# Vivado block design design_2, xc7a100tcsg324-1, Vivado 2021.2
# (continued, part 2 of 3)
current_bd_instance /NN/Multiplier_Adder_Relu_6

# ---- hierarchy /NN/Multiplier_Adder_Relu_7 ----
current_bd_instance /NN/Multiplier_Adder_Relu_7
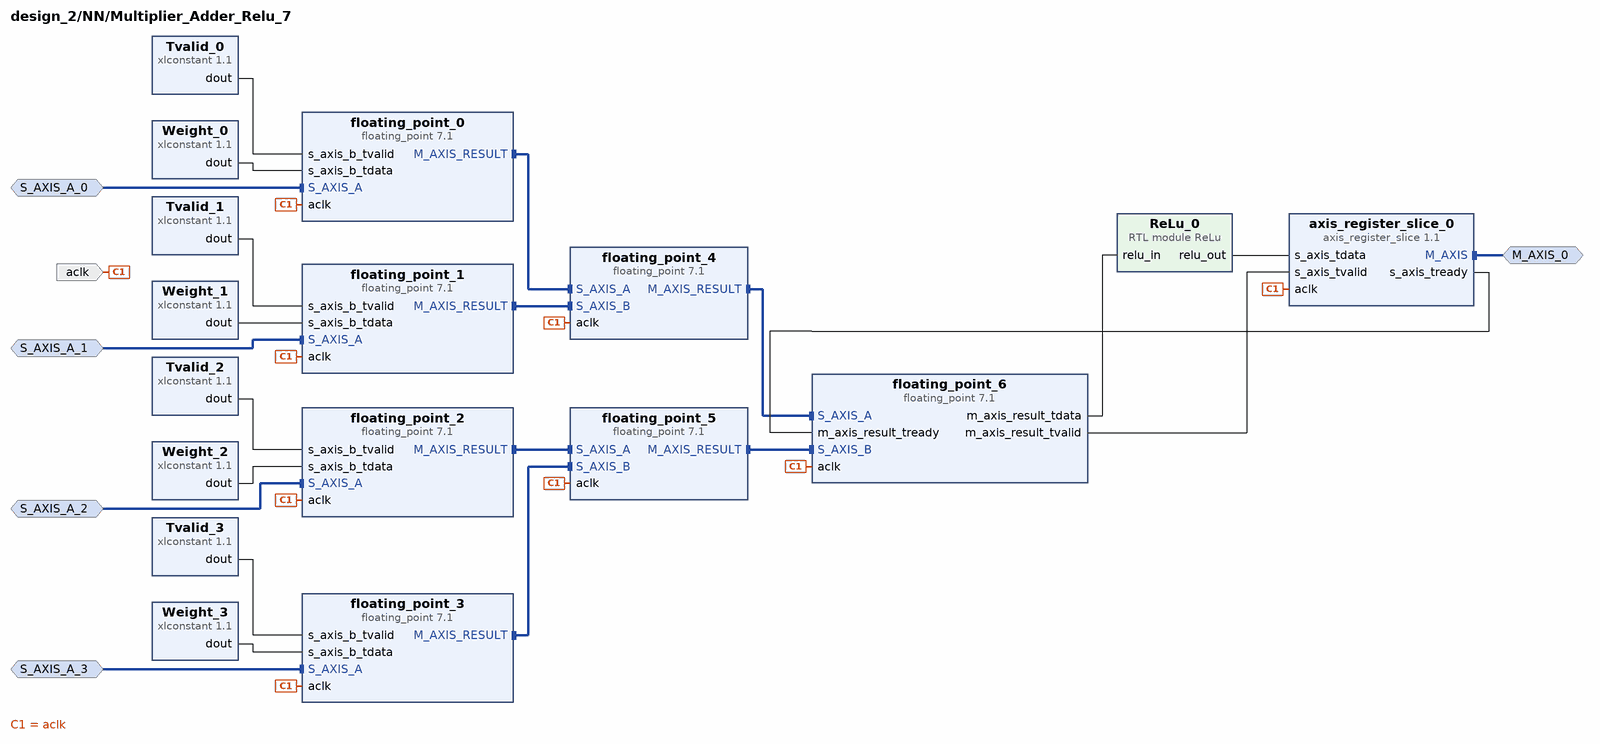
[diagram p10: block diagram inside /NN/Multiplier_Adder_Relu_7]
create_bd_intf_pin -mode Master -vlnv xilinx.com:interface:axis_rtl:1.0 M_AXIS_0
create_bd_intf_pin -mode Slave -vlnv xilinx.com:interface:axis_rtl:1.0 S_AXIS_A_0
create_bd_intf_pin -mode Slave -vlnv xilinx.com:interface:axis_rtl:1.0 S_AXIS_A_1
create_bd_intf_pin -mode Slave -vlnv xilinx.com:interface:axis_rtl:1.0 S_AXIS_A_2
create_bd_intf_pin -mode Slave -vlnv xilinx.com:interface:axis_rtl:1.0 S_AXIS_A_3
create_bd_pin -dir I -type clk aclk

create_bd_cell -type ip -vlnv xilinx.com:ip:floating_point:7.1 floating_point_2
set_property -dict [list \
  CONFIG.C_Latency 9 \
  CONFIG.C_Mult_Usage Full_Usage \
  CONFIG.C_Rate 1 \
  CONFIG.C_Result_Exponent_Width 8 \
  CONFIG.C_Result_Fraction_Width 24 \
  CONFIG.Maximum_Latency true \
  CONFIG.Operation_Type Multiply \
  CONFIG.Result_Precision_Type Single \
] [get_bd_cells floating_point_2]
create_bd_cell -type ip -vlnv xilinx.com:ip:floating_point:7.1 floating_point_3
set_property -dict [list \
  CONFIG.C_Latency 9 \
  CONFIG.C_Mult_Usage Full_Usage \
  CONFIG.C_Rate 1 \
  CONFIG.C_Result_Exponent_Width 8 \
  CONFIG.C_Result_Fraction_Width 24 \
  CONFIG.Maximum_Latency true \
  CONFIG.Operation_Type Multiply \
  CONFIG.Result_Precision_Type Single \
] [get_bd_cells floating_point_3]
create_bd_cell -type ip -vlnv xilinx.com:ip:floating_point:7.1 floating_point_0
set_property -dict [list \
  CONFIG.C_Latency 9 \
  CONFIG.C_Mult_Usage Full_Usage \
  CONFIG.C_Rate 1 \
  CONFIG.C_Result_Exponent_Width 8 \
  CONFIG.C_Result_Fraction_Width 24 \
  CONFIG.Has_ARESETn false \
  CONFIG.Has_B_TLAST false \
  CONFIG.Maximum_Latency true \
  CONFIG.Operation_Type Multiply \
  CONFIG.RESULT_TLAST_Behv Null \
  CONFIG.Result_Precision_Type Single \
] [get_bd_cells floating_point_0]
create_bd_cell -type ip -vlnv xilinx.com:ip:floating_point:7.1 floating_point_1
set_property -dict [list \
  CONFIG.C_Latency 9 \
  CONFIG.C_Mult_Usage Full_Usage \
  CONFIG.C_Rate 1 \
  CONFIG.C_Result_Exponent_Width 8 \
  CONFIG.C_Result_Fraction_Width 24 \
  CONFIG.Maximum_Latency true \
  CONFIG.Operation_Type Multiply \
  CONFIG.Result_Precision_Type Single \
] [get_bd_cells floating_point_1]
create_bd_cell -type ip -vlnv xilinx.com:ip:floating_point:7.1 floating_point_4
set_property -dict [list \
  CONFIG.Add_Sub_Value Add \
  CONFIG.C_Latency 12 \
  CONFIG.C_Mult_Usage Full_Usage \
  CONFIG.C_Rate 1 \
  CONFIG.C_Result_Exponent_Width 8 \
  CONFIG.C_Result_Fraction_Width 24 \
  CONFIG.Maximum_Latency true \
  CONFIG.Operation_Type Add_Subtract \
  CONFIG.Result_Precision_Type Single \
] [get_bd_cells floating_point_4]
create_bd_cell -type ip -vlnv xilinx.com:ip:floating_point:7.1 floating_point_5
set_property -dict [list \
  CONFIG.Add_Sub_Value Add \
  CONFIG.C_Latency 12 \
  CONFIG.C_Mult_Usage Full_Usage \
  CONFIG.C_Rate 1 \
  CONFIG.C_Result_Exponent_Width 8 \
  CONFIG.C_Result_Fraction_Width 24 \
  CONFIG.Maximum_Latency true \
  CONFIG.Operation_Type Add_Subtract \
  CONFIG.Result_Precision_Type Single \
] [get_bd_cells floating_point_5]
create_bd_cell -type ip -vlnv xilinx.com:ip:floating_point:7.1 floating_point_6
set_property -dict [list \
  CONFIG.Add_Sub_Value Add \
  CONFIG.C_Latency 12 \
  CONFIG.C_Mult_Usage Full_Usage \
  CONFIG.C_Rate 1 \
  CONFIG.C_Result_Exponent_Width 8 \
  CONFIG.C_Result_Fraction_Width 24 \
  CONFIG.Maximum_Latency true \
  CONFIG.Operation_Type Add_Subtract \
  CONFIG.Result_Precision_Type Single \
] [get_bd_cells floating_point_6]
create_bd_cell -type ip -vlnv xilinx.com:ip:xlconstant:1.1 Weight_0
set_property -dict {CONFIG.CONST_VAL b00111111010010101100111101101010 CONFIG.CONST_WIDTH 32} [get_bd_cells Weight_0]
create_bd_cell -type ip -vlnv xilinx.com:ip:xlconstant:1.1 Weight_1
set_property -dict {CONFIG.CONST_VAL b00111011011111100010111110101010 CONFIG.CONST_WIDTH 32} [get_bd_cells Weight_1]
create_bd_cell -type ip -vlnv xilinx.com:ip:xlconstant:1.1 Weight_2
set_property -dict {CONFIG.CONST_VAL b00111110101011001100011001111010 CONFIG.CONST_WIDTH 32} [get_bd_cells Weight_2]
create_bd_cell -type ip -vlnv xilinx.com:ip:xlconstant:1.1 Weight_3
set_property -dict {CONFIG.CONST_VAL b11000000001010001011100101101110 CONFIG.CONST_WIDTH 32} [get_bd_cells Weight_3]
create_bd_cell -type ip -vlnv xilinx.com:ip:axis_register_slice:1.1 axis_register_slice_0
set_property -dict {CONFIG.TDATA_NUM_BYTES 4} [get_bd_cells axis_register_slice_0]
create_bd_cell -type ip -vlnv xilinx.com:ip:xlconstant:1.1 Tvalid_0
set_property -dict {CONFIG.CONST_WIDTH 1} [get_bd_cells Tvalid_0]
create_bd_cell -type ip -vlnv xilinx.com:ip:xlconstant:1.1 Tvalid_1
set_property -dict {CONFIG.CONST_WIDTH 1} [get_bd_cells Tvalid_1]
create_bd_cell -type ip -vlnv xilinx.com:ip:xlconstant:1.1 Tvalid_2
set_property -dict {CONFIG.CONST_WIDTH 1} [get_bd_cells Tvalid_2]
create_bd_cell -type ip -vlnv xilinx.com:ip:xlconstant:1.1 Tvalid_3
set_property -dict {CONFIG.CONST_WIDTH 1} [get_bd_cells Tvalid_3]
create_bd_cell -type module -reference ReLu ReLu_0

# ---- connections ----

current_bd_instance /microblaze_0_local_memory
connect_bd_intf_net [get_bd_intf_pins DLMB] [get_bd_intf_pins dlmb_v10/LMB_M]
connect_bd_intf_net [get_bd_intf_pins dlmb_v10/LMB_Sl_0] [get_bd_intf_pins dlmb_bram_if_cntlr/SLMB]
connect_bd_intf_net [get_bd_intf_pins dlmb_bram_if_cntlr/BRAM_PORT] [get_bd_intf_pins lmb_bram/BRAM_PORTA]
connect_bd_intf_net [get_bd_intf_pins ILMB] [get_bd_intf_pins ilmb_v10/LMB_M]
connect_bd_intf_net [get_bd_intf_pins ilmb_v10/LMB_Sl_0] [get_bd_intf_pins ilmb_bram_if_cntlr/SLMB]
connect_bd_intf_net [get_bd_intf_pins ilmb_bram_if_cntlr/BRAM_PORT] [get_bd_intf_pins lmb_bram/BRAM_PORTB]
connect_bd_net [get_bd_pins SYS_Rst] \
  [get_bd_pins dlmb_v10/SYS_Rst] [get_bd_pins dlmb_bram_if_cntlr/LMB_Rst] [get_bd_pins ilmb_v10/SYS_Rst] \
  [get_bd_pins ilmb_bram_if_cntlr/LMB_Rst]
connect_bd_net -net microblaze_0_Clk [get_bd_pins LMB_Clk] \
  [get_bd_pins dlmb_v10/LMB_Clk] [get_bd_pins dlmb_bram_if_cntlr/LMB_Clk] [get_bd_pins ilmb_v10/LMB_Clk] \
  [get_bd_pins ilmb_bram_if_cntlr/LMB_Clk]
set_property HDL_ATTRIBUTE.BMM_INFO_ADDRESS_SPACE {byte  0x00000000 32 > design_2 microblaze_0_local_memory/lmb_bram} [get_bd_cells dlmb_bram_if_cntlr]
set_property HDL_ATTRIBUTE.KEEP_HIERARCHY yes [get_bd_cells dlmb_bram_if_cntlr]

current_bd_instance /NN
connect_bd_intf_net [get_bd_intf_pins Multiplier_Adder_Relu_0/M_AXIS_0] [get_bd_intf_pins S_axi_Demultiplexer1_0/s_axis_in]
connect_bd_intf_net [get_bd_intf_pins Multiplier_Adder_Relu_1/M_AXIS_0] [get_bd_intf_pins S_axi_Demultiplexer1_1/s_axis_in]
connect_bd_intf_net [get_bd_intf_pins S_axi_Demultiplexer1_2/s_axis_in] [get_bd_intf_pins Multiplier_Adder_Relu_2/M_AXIS_0]
connect_bd_intf_net [get_bd_intf_pins Multiplier_Adder_Relu_3/M_AXIS_0] [get_bd_intf_pins S_axi_Demultiplexer1_3/s_axis_in]
connect_bd_intf_net [get_bd_intf_pins Multiplier_Adder_Relu_4/M_AXIS_0] [get_bd_intf_pins axi_fifo_mm_s_0/AXI_STR_RXD]
connect_bd_intf_net [get_bd_intf_pins Multiplier_Adder_Relu_4/M_AXIS_0] [get_bd_intf_pins M_AXIS_0]
connect_bd_intf_net [get_bd_intf_pins Multiplier_Adder_Relu_5/M_AXIS_0] [get_bd_intf_pins axi_fifo_mm_s_1/AXI_STR_RXD]
connect_bd_intf_net [get_bd_intf_pins Multiplier_Adder_Relu_5/M_AXIS_0] [get_bd_intf_pins M_AXIS_1]
connect_bd_intf_net [get_bd_intf_pins Multiplier_Adder_Relu_6/M_AXIS_0] [get_bd_intf_pins axi_fifo_mm_s_2/AXI_STR_RXD]
connect_bd_intf_net [get_bd_intf_pins Multiplier_Adder_Relu_6/M_AXIS_0] [get_bd_intf_pins M_AXIS_2]
connect_bd_intf_net [get_bd_intf_pins Multiplier_Adder_Relu_7/M_AXIS_0] [get_bd_intf_pins axi_fifo_mm_s_3/AXI_STR_RXD]
connect_bd_intf_net [get_bd_intf_pins Multiplier_Adder_Relu_7/M_AXIS_0] [get_bd_intf_pins M_AXIS_3]
connect_bd_intf_net [get_bd_intf_pins S_axi_Demultiplexer1_0/s_axis_out0] [get_bd_intf_pins Multiplier_Adder_Relu_4/S_AXIS_A_0]
connect_bd_intf_net [get_bd_intf_pins S_axi_Demultiplexer1_0/s_axis_out1] [get_bd_intf_pins Multiplier_Adder_Relu_5/S_AXIS_A_0]
connect_bd_intf_net [get_bd_intf_pins S_axi_Demultiplexer1_0/s_axis_out2] [get_bd_intf_pins Multiplier_Adder_Relu_6/S_AXIS_A_0]
connect_bd_intf_net [get_bd_intf_pins S_axi_Demultiplexer1_0/s_axis_out3] [get_bd_intf_pins Multiplier_Adder_Relu_7/S_AXIS_A_0]
connect_bd_intf_net [get_bd_intf_pins S_axi_Demultiplexer1_1/s_axis_out0] [get_bd_intf_pins Multiplier_Adder_Relu_4/S_AXIS_A_1]
connect_bd_intf_net [get_bd_intf_pins S_axi_Demultiplexer1_1/s_axis_out1] [get_bd_intf_pins Multiplier_Adder_Relu_5/S_AXIS_A_1]
connect_bd_intf_net [get_bd_intf_pins S_axi_Demultiplexer1_1/s_axis_out2] [get_bd_intf_pins Multiplier_Adder_Relu_6/S_AXIS_A_1]
connect_bd_intf_net [get_bd_intf_pins S_axi_Demultiplexer1_1/s_axis_out3] [get_bd_intf_pins Multiplier_Adder_Relu_7/S_AXIS_A_1]
connect_bd_intf_net [get_bd_intf_pins S_axi_Demultiplexer1_2/s_axis_out0] [get_bd_intf_pins Multiplier_Adder_Relu_4/S_AXIS_A_2]
connect_bd_intf_net [get_bd_intf_pins S_axi_Demultiplexer1_2/s_axis_out1] [get_bd_intf_pins Multiplier_Adder_Relu_5/S_AXIS_A_2]
connect_bd_intf_net [get_bd_intf_pins S_axi_Demultiplexer1_2/s_axis_out2] [get_bd_intf_pins Multiplier_Adder_Relu_6/S_AXIS_A_2]
connect_bd_intf_net [get_bd_intf_pins S_axi_Demultiplexer1_2/s_axis_out3] [get_bd_intf_pins Multiplier_Adder_Relu_7/S_AXIS_A_2]
connect_bd_intf_net [get_bd_intf_pins S_axi_Demultiplexer1_3/s_axis_out0] [get_bd_intf_pins Multiplier_Adder_Relu_4/S_AXIS_A_3]
connect_bd_intf_net [get_bd_intf_pins S_axi_Demultiplexer1_3/s_axis_out1] [get_bd_intf_pins Multiplier_Adder_Relu_5/S_AXIS_A_3]
connect_bd_intf_net [get_bd_intf_pins S_axi_Demultiplexer1_3/s_axis_out2] [get_bd_intf_pins Multiplier_Adder_Relu_6/S_AXIS_A_3]
connect_bd_intf_net [get_bd_intf_pins S_axi_Demultiplexer1_3/s_axis_out3] [get_bd_intf_pins Multiplier_Adder_Relu_7/S_AXIS_A_3]
connect_bd_intf_net [get_bd_intf_pins S_AXI4] [get_bd_intf_pins control/S_AXI]
connect_bd_intf_net [get_bd_intf_pins S_AXI5] [get_bd_intf_pins src_0/S_AXI]
connect_bd_intf_net [get_bd_intf_pins S_AXI6] [get_bd_intf_pins src_1/S_AXI]
connect_bd_intf_net [get_bd_intf_pins S_AXI7] [get_bd_intf_pins src_2/S_AXI]
connect_bd_intf_net [get_bd_intf_pins S_AXI8] [get_bd_intf_pins src_3/S_AXI]
connect_bd_intf_net [get_bd_intf_pins S_AXI] [get_bd_intf_pins axi_fifo_mm_s_0/S_AXI]
connect_bd_intf_net [get_bd_intf_pins S_AXI1] [get_bd_intf_pins axi_fifo_mm_s_1/S_AXI]
connect_bd_intf_net [get_bd_intf_pins S_AXI2] [get_bd_intf_pins axi_fifo_mm_s_2/S_AXI]
connect_bd_intf_net [get_bd_intf_pins S_AXI3] [get_bd_intf_pins axi_fifo_mm_s_3/S_AXI]
connect_bd_net [get_bd_pins Multiplier_Adder_Relu_4/M_AXIS_0_tdata] [get_bd_pins M_AXIS_0_tdata]
connect_bd_net [get_bd_pins Multiplier_Adder_Relu_5/M_AXIS_0_tdata] [get_bd_pins M_AXIS_0_tdata1]
connect_bd_net [get_bd_pins Multiplier_Adder_Relu_6/M_AXIS_0_tdata] [get_bd_pins M_AXIS_0_tdata2]
connect_bd_net [get_bd_pins Multiplier_Adder_Relu_7/M_AXIS_0_tdata] [get_bd_pins M_AXIS_0_tdata3]
connect_bd_net -net S_AXIS_A_2_tdata_1 [get_bd_pins src_2/gpio_io_o] \
  [get_bd_pins Multiplier_Adder_Relu_0/S_AXIS_A_2_tdata] [get_bd_pins Multiplier_Adder_Relu_1/S_AXIS_A_2_tdata] \
  [get_bd_pins Multiplier_Adder_Relu_3/S_AXIS_A_2_tdata] [get_bd_pins Multiplier_Adder_Relu_2/S_AXIS_A_2_tdata]
connect_bd_net -net S_AXIS_A_3_tdata_1 [get_bd_pins src_3/gpio_io_o] \
  [get_bd_pins Multiplier_Adder_Relu_3/S_AXIS_A_3_tdata] [get_bd_pins Multiplier_Adder_Relu_1/S_AXIS_A_3_tdata] \
  [get_bd_pins Multiplier_Adder_Relu_0/S_AXIS_A_3_tdata] [get_bd_pins Multiplier_Adder_Relu_2/S_AXIS_A_3_tdata]
connect_bd_net -net axi_gpio_0_gpio_io_o [get_bd_pins src_0/gpio_io_o] \
  [get_bd_pins Multiplier_Adder_Relu_0/S_AXIS_A_0_tdata] [get_bd_pins Multiplier_Adder_Relu_1/S_AXIS_A_0_tdata] \
  [get_bd_pins Multiplier_Adder_Relu_3/S_AXIS_A_0_tdata] [get_bd_pins Multiplier_Adder_Relu_2/S_AXIS_A_0_tdata]
connect_bd_net -net control_gpio_io_o [get_bd_pins control/gpio_io_o] \
  [get_bd_pins S_AXIS_A_0_tvalid] [get_bd_pins Multiplier_Adder_Relu_0/S_AXIS_A_0_tvalid] \
  [get_bd_pins Multiplier_Adder_Relu_0/S_AXIS_A_1_tvalid] [get_bd_pins Multiplier_Adder_Relu_0/S_AXIS_A_2_tvalid] \
  [get_bd_pins Multiplier_Adder_Relu_0/S_AXIS_A_3_tvalid] [get_bd_pins Multiplier_Adder_Relu_1/S_AXIS_A_0_tvalid] \
  [get_bd_pins Multiplier_Adder_Relu_1/S_AXIS_A_1_tvalid] [get_bd_pins Multiplier_Adder_Relu_1/S_AXIS_A_2_tvalid] \
  [get_bd_pins Multiplier_Adder_Relu_1/S_AXIS_A_3_tvalid] [get_bd_pins Multiplier_Adder_Relu_3/S_AXIS_A_0_tvalid] \
  [get_bd_pins Multiplier_Adder_Relu_3/S_AXIS_A_1_tvalid] [get_bd_pins Multiplier_Adder_Relu_3/S_AXIS_A_2_tvalid] \
  [get_bd_pins Multiplier_Adder_Relu_3/S_AXIS_A_3_tvalid] [get_bd_pins Multiplier_Adder_Relu_2/S_AXIS_A_0_tvalid] \
  [get_bd_pins Multiplier_Adder_Relu_2/S_AXIS_A_3_tvalid] [get_bd_pins Multiplier_Adder_Relu_2/S_AXIS_A_2_tvalid] \
  [get_bd_pins Multiplier_Adder_Relu_2/S_AXIS_A_1_tvalid]
connect_bd_net -net input_1_gpio_io_o [get_bd_pins src_1/gpio_io_o] \
  [get_bd_pins Multiplier_Adder_Relu_0/S_AXIS_A_1_tdata] [get_bd_pins Multiplier_Adder_Relu_1/S_AXIS_A_1_tdata] \
  [get_bd_pins Multiplier_Adder_Relu_3/S_AXIS_A_1_tdata] [get_bd_pins Multiplier_Adder_Relu_2/S_AXIS_A_1_tdata]
connect_bd_net -net microblaze_0_Clk [get_bd_pins aclk] \
  [get_bd_pins Multiplier_Adder_Relu_0/aclk] [get_bd_pins control/s_axi_aclk] [get_bd_pins src_0/s_axi_aclk] \
  [get_bd_pins src_1/s_axi_aclk] [get_bd_pins src_2/s_axi_aclk] [get_bd_pins src_3/s_axi_aclk] \
  [get_bd_pins Multiplier_Adder_Relu_1/aclk] [get_bd_pins Multiplier_Adder_Relu_3/aclk] \
  [get_bd_pins Multiplier_Adder_Relu_4/aclk] [get_bd_pins Multiplier_Adder_Relu_5/aclk] \
  [get_bd_pins Multiplier_Adder_Relu_6/aclk] [get_bd_pins Multiplier_Adder_Relu_7/aclk] \
  [get_bd_pins axi_fifo_mm_s_1/s_axi_aclk] [get_bd_pins axi_fifo_mm_s_2/s_axi_aclk] [get_bd_pins axi_fifo_mm_s_3/s_axi_aclk] \
  [get_bd_pins Multiplier_Adder_Relu_2/aclk] [get_bd_pins axi_fifo_mm_s_0/s_axi_aclk]
connect_bd_net -net rst_clk_wiz_0_100M_peripheral_aresetn [get_bd_pins s_axi_aresetn] \
  [get_bd_pins control/s_axi_aresetn] [get_bd_pins src_0/s_axi_aresetn] [get_bd_pins src_1/s_axi_aresetn] \
  [get_bd_pins src_2/s_axi_aresetn] [get_bd_pins src_3/s_axi_aresetn] [get_bd_pins axi_fifo_mm_s_1/s_axi_aresetn] \
  [get_bd_pins axi_fifo_mm_s_2/s_axi_aresetn] [get_bd_pins axi_fifo_mm_s_3/s_axi_aresetn] \
  [get_bd_pins axi_fifo_mm_s_0/s_axi_aresetn]
set_property HDL_ATTRIBUTE.DEBUG true [get_bd_nets control_gpio_io_o]

current_bd_instance /NN/Multiplier_Adder_Relu_0
connect_bd_intf_net [get_bd_intf_pins M_AXIS_0] [get_bd_intf_pins axis_register_slice_0/M_AXIS]
connect_bd_intf_net [get_bd_intf_pins S_AXIS_A_0] [get_bd_intf_pins floating_point_0/S_AXIS_A]
connect_bd_intf_net [get_bd_intf_pins S_AXIS_A_1] [get_bd_intf_pins floating_point_1/S_AXIS_A]
connect_bd_intf_net [get_bd_intf_pins S_AXIS_A_2] [get_bd_intf_pins floating_point_2/S_AXIS_A]
connect_bd_intf_net [get_bd_intf_pins S_AXIS_A_3] [get_bd_intf_pins floating_point_3/S_AXIS_A]
connect_bd_intf_net [get_bd_intf_pins floating_point_0/M_AXIS_RESULT] [get_bd_intf_pins floating_point_4/S_AXIS_A]
connect_bd_intf_net [get_bd_intf_pins floating_point_1/M_AXIS_RESULT] [get_bd_intf_pins floating_point_4/S_AXIS_B]
connect_bd_intf_net [get_bd_intf_pins floating_point_2/M_AXIS_RESULT] [get_bd_intf_pins floating_point_5/S_AXIS_A]
connect_bd_intf_net [get_bd_intf_pins floating_point_3/M_AXIS_RESULT] [get_bd_intf_pins floating_point_5/S_AXIS_B]
connect_bd_intf_net [get_bd_intf_pins floating_point_4/M_AXIS_RESULT] [get_bd_intf_pins floating_point_6/S_AXIS_A]
connect_bd_intf_net [get_bd_intf_pins floating_point_5/M_AXIS_RESULT] [get_bd_intf_pins floating_point_6/S_AXIS_B]
connect_bd_net -net ReLu_0_output [get_bd_pins ReLu_0/relu_out] [get_bd_pins axis_register_slice_0/s_axis_tdata]
connect_bd_net [get_bd_pins Tvalid_0/dout] [get_bd_pins floating_point_0/s_axis_b_tvalid]
connect_bd_net [get_bd_pins Tvalid_1/dout] [get_bd_pins floating_point_1/s_axis_b_tvalid]
connect_bd_net [get_bd_pins Tvalid_2/dout] [get_bd_pins floating_point_2/s_axis_b_tvalid]
connect_bd_net [get_bd_pins Tvalid_3/dout] [get_bd_pins floating_point_3/s_axis_b_tvalid]
connect_bd_net [get_bd_pins Weight_1/dout] [get_bd_pins floating_point_1/s_axis_b_tdata]
connect_bd_net [get_bd_pins Weight_2/dout] [get_bd_pins floating_point_2/s_axis_b_tdata]
connect_bd_net [get_bd_pins Weight_3/dout] [get_bd_pins floating_point_3/s_axis_b_tdata]
connect_bd_net [get_bd_pins aclk] \
  [get_bd_pins floating_point_4/aclk] [get_bd_pins floating_point_6/aclk] [get_bd_pins floating_point_1/aclk] \
  [get_bd_pins floating_point_0/aclk] [get_bd_pins floating_point_5/aclk] [get_bd_pins floating_point_3/aclk] \
  [get_bd_pins floating_point_2/aclk] [get_bd_pins axis_register_slice_0/aclk]
connect_bd_net [get_bd_pins axis_register_slice_0/s_axis_tready] [get_bd_pins floating_point_6/m_axis_result_tready]
connect_bd_net [get_bd_pins floating_point_6/m_axis_result_tdata] [get_bd_pins ReLu_0/relu_in]
connect_bd_net [get_bd_pins floating_point_6/m_axis_result_tvalid] [get_bd_pins axis_register_slice_0/s_axis_tvalid]
connect_bd_net -net xlconstant_0_dout [get_bd_pins Weight_0/dout] [get_bd_pins floating_point_0/s_axis_b_tdata]

current_bd_instance /NN/Multiplier_Adder_Relu_1
connect_bd_intf_net [get_bd_intf_pins M_AXIS_0] [get_bd_intf_pins axis_register_slice_0/M_AXIS]
connect_bd_intf_net [get_bd_intf_pins S_AXIS_A_0] [get_bd_intf_pins floating_point_0/S_AXIS_A]
connect_bd_intf_net [get_bd_intf_pins S_AXIS_A_1] [get_bd_intf_pins floating_point_1/S_AXIS_A]
connect_bd_intf_net [get_bd_intf_pins S_AXIS_A_2] [get_bd_intf_pins floating_point_2/S_AXIS_A]
connect_bd_intf_net [get_bd_intf_pins S_AXIS_A_3] [get_bd_intf_pins floating_point_3/S_AXIS_A]
connect_bd_intf_net [get_bd_intf_pins floating_point_0/M_AXIS_RESULT] [get_bd_intf_pins floating_point_4/S_AXIS_A]
connect_bd_intf_net [get_bd_intf_pins floating_point_1/M_AXIS_RESULT] [get_bd_intf_pins floating_point_4/S_AXIS_B]
connect_bd_intf_net [get_bd_intf_pins floating_point_2/M_AXIS_RESULT] [get_bd_intf_pins floating_point_5/S_AXIS_A]
connect_bd_intf_net [get_bd_intf_pins floating_point_3/M_AXIS_RESULT] [get_bd_intf_pins floating_point_5/S_AXIS_B]
connect_bd_intf_net [get_bd_intf_pins floating_point_4/M_AXIS_RESULT] [get_bd_intf_pins floating_point_6/S_AXIS_A]
connect_bd_intf_net [get_bd_intf_pins floating_point_5/M_AXIS_RESULT] [get_bd_intf_pins floating_point_6/S_AXIS_B]
connect_bd_net -net ReLu_0_output [get_bd_pins ReLu_0/relu_out] [get_bd_pins axis_register_slice_0/s_axis_tdata]
connect_bd_net [get_bd_pins Tvalid_0/dout] [get_bd_pins floating_point_0/s_axis_b_tvalid]
connect_bd_net [get_bd_pins Tvalid_1/dout] [get_bd_pins floating_point_1/s_axis_b_tvalid]
connect_bd_net [get_bd_pins Tvalid_2/dout] [get_bd_pins floating_point_2/s_axis_b_tvalid]
connect_bd_net [get_bd_pins Tvalid_3/dout] [get_bd_pins floating_point_3/s_axis_b_tvalid]
connect_bd_net [get_bd_pins Weight_1/dout] [get_bd_pins floating_point_1/s_axis_b_tdata]
connect_bd_net [get_bd_pins Weight_2/dout] [get_bd_pins floating_point_2/s_axis_b_tdata]
connect_bd_net [get_bd_pins Weight_3/dout] [get_bd_pins floating_point_3/s_axis_b_tdata]
connect_bd_net [get_bd_pins aclk] \
  [get_bd_pins floating_point_4/aclk] [get_bd_pins floating_point_6/aclk] [get_bd_pins floating_point_1/aclk] \
  [get_bd_pins floating_point_0/aclk] [get_bd_pins floating_point_5/aclk] [get_bd_pins floating_point_3/aclk] \
  [get_bd_pins floating_point_2/aclk] [get_bd_pins axis_register_slice_0/aclk]
connect_bd_net [get_bd_pins axis_register_slice_0/s_axis_tready] [get_bd_pins floating_point_6/m_axis_result_tready]
connect_bd_net [get_bd_pins floating_point_6/m_axis_result_tdata] [get_bd_pins ReLu_0/relu_in]
connect_bd_net [get_bd_pins floating_point_6/m_axis_result_tvalid] [get_bd_pins axis_register_slice_0/s_axis_tvalid]
connect_bd_net -net xlconstant_0_dout [get_bd_pins Weight_0/dout] [get_bd_pins floating_point_0/s_axis_b_tdata]

current_bd_instance /NN/Multiplier_Adder_Relu_2
connect_bd_intf_net [get_bd_intf_pins M_AXIS_0] [get_bd_intf_pins axis_register_slice_0/M_AXIS]
connect_bd_intf_net [get_bd_intf_pins S_AXIS_A_0] [get_bd_intf_pins floating_point_0/S_AXIS_A]
connect_bd_intf_net [get_bd_intf_pins S_AXIS_A_1] [get_bd_intf_pins floating_point_1/S_AXIS_A]
connect_bd_intf_net [get_bd_intf_pins S_AXIS_A_2] [get_bd_intf_pins floating_point_2/S_AXIS_A]
connect_bd_intf_net [get_bd_intf_pins S_AXIS_A_3] [get_bd_intf_pins floating_point_3/S_AXIS_A]
connect_bd_intf_net [get_bd_intf_pins floating_point_0/M_AXIS_RESULT] [get_bd_intf_pins floating_point_4/S_AXIS_A]
connect_bd_intf_net [get_bd_intf_pins floating_point_1/M_AXIS_RESULT] [get_bd_intf_pins floating_point_4/S_AXIS_B]
connect_bd_intf_net [get_bd_intf_pins floating_point_2/M_AXIS_RESULT] [get_bd_intf_pins floating_point_5/S_AXIS_A]
connect_bd_intf_net [get_bd_intf_pins floating_point_3/M_AXIS_RESULT] [get_bd_intf_pins floating_point_5/S_AXIS_B]
connect_bd_intf_net [get_bd_intf_pins floating_point_4/M_AXIS_RESULT] [get_bd_intf_pins floating_point_6/S_AXIS_A]
connect_bd_intf_net [get_bd_intf_pins floating_point_5/M_AXIS_RESULT] [get_bd_intf_pins floating_point_6/S_AXIS_B]
connect_bd_net -net ReLu_0_output [get_bd_pins ReLu_0/relu_out] [get_bd_pins axis_register_slice_0/s_axis_tdata]
connect_bd_net [get_bd_pins Tvalid_0/dout] [get_bd_pins floating_point_0/s_axis_b_tvalid]
connect_bd_net [get_bd_pins Tvalid_1/dout] [get_bd_pins floating_point_1/s_axis_b_tvalid]
connect_bd_net [get_bd_pins Tvalid_2/dout] [get_bd_pins floating_point_2/s_axis_b_tvalid]
connect_bd_net [get_bd_pins Tvalid_3/dout] [get_bd_pins floating_point_3/s_axis_b_tvalid]
connect_bd_net [get_bd_pins Weight_1/dout] [get_bd_pins floating_point_1/s_axis_b_tdata]
connect_bd_net [get_bd_pins Weight_2/dout] [get_bd_pins floating_point_2/s_axis_b_tdata]
connect_bd_net [get_bd_pins Weight_3/dout] [get_bd_pins floating_point_3/s_axis_b_tdata]
connect_bd_net [get_bd_pins aclk] \
  [get_bd_pins floating_point_4/aclk] [get_bd_pins floating_point_6/aclk] [get_bd_pins floating_point_1/aclk] \
  [get_bd_pins floating_point_0/aclk] [get_bd_pins floating_point_5/aclk] [get_bd_pins floating_point_3/aclk] \
  [get_bd_pins floating_point_2/aclk] [get_bd_pins axis_register_slice_0/aclk]
connect_bd_net [get_bd_pins axis_register_slice_0/s_axis_tready] [get_bd_pins floating_point_6/m_axis_result_tready]
connect_bd_net [get_bd_pins floating_point_6/m_axis_result_tdata] [get_bd_pins ReLu_0/relu_in]
connect_bd_net [get_bd_pins floating_point_6/m_axis_result_tvalid] [get_bd_pins axis_register_slice_0/s_axis_tvalid]
connect_bd_net -net xlconstant_0_dout [get_bd_pins Weight_0/dout] [get_bd_pins floating_point_0/s_axis_b_tdata]

current_bd_instance /NN/Multiplier_Adder_Relu_3
connect_bd_intf_net [get_bd_intf_pins M_AXIS_0] [get_bd_intf_pins axis_register_slice_0/M_AXIS]
connect_bd_intf_net [get_bd_intf_pins S_AXIS_A_0] [get_bd_intf_pins floating_point_0/S_AXIS_A]
connect_bd_intf_net [get_bd_intf_pins S_AXIS_A_1] [get_bd_intf_pins floating_point_1/S_AXIS_A]
connect_bd_intf_net [get_bd_intf_pins S_AXIS_A_2] [get_bd_intf_pins floating_point_2/S_AXIS_A]
connect_bd_intf_net [get_bd_intf_pins S_AXIS_A_3] [get_bd_intf_pins floating_point_3/S_AXIS_A]
connect_bd_intf_net [get_bd_intf_pins floating_point_0/M_AXIS_RESULT] [get_bd_intf_pins floating_point_4/S_AXIS_A]
connect_bd_intf_net [get_bd_intf_pins floating_point_1/M_AXIS_RESULT] [get_bd_intf_pins floating_point_4/S_AXIS_B]
connect_bd_intf_net [get_bd_intf_pins floating_point_2/M_AXIS_RESULT] [get_bd_intf_pins floating_point_5/S_AXIS_A]
connect_bd_intf_net [get_bd_intf_pins floating_point_3/M_AXIS_RESULT] [get_bd_intf_pins floating_point_5/S_AXIS_B]
connect_bd_intf_net [get_bd_intf_pins floating_point_4/M_AXIS_RESULT] [get_bd_intf_pins floating_point_6/S_AXIS_A]
connect_bd_intf_net [get_bd_intf_pins floating_point_5/M_AXIS_RESULT] [get_bd_intf_pins floating_point_6/S_AXIS_B]
connect_bd_net -net ReLu_0_output [get_bd_pins ReLu_0/relu_out] [get_bd_pins axis_register_slice_0/s_axis_tdata]
connect_bd_net [get_bd_pins Tvalid_0/dout] [get_bd_pins floating_point_0/s_axis_b_tvalid]
connect_bd_net [get_bd_pins Tvalid_1/dout] [get_bd_pins floating_point_1/s_axis_b_tvalid]
connect_bd_net [get_bd_pins Tvalid_2/dout] [get_bd_pins floating_point_2/s_axis_b_tvalid]
connect_bd_net [get_bd_pins Tvalid_3/dout] [get_bd_pins floating_point_3/s_axis_b_tvalid]
connect_bd_net [get_bd_pins Weight_1/dout] [get_bd_pins floating_point_1/s_axis_b_tdata]
connect_bd_net [get_bd_pins Weight_2/dout] [get_bd_pins floating_point_2/s_axis_b_tdata]
connect_bd_net [get_bd_pins Weight_3/dout] [get_bd_pins floating_point_3/s_axis_b_tdata]
connect_bd_net [get_bd_pins aclk] \
  [get_bd_pins floating_point_4/aclk] [get_bd_pins floating_point_6/aclk] [get_bd_pins floating_point_1/aclk] \
  [get_bd_pins floating_point_0/aclk] [get_bd_pins floating_point_5/aclk] [get_bd_pins floating_point_3/aclk] \
  [get_bd_pins floating_point_2/aclk] [get_bd_pins axis_register_slice_0/aclk]
connect_bd_net [get_bd_pins axis_register_slice_0/s_axis_tready] [get_bd_pins floating_point_6/m_axis_result_tready]
connect_bd_net [get_bd_pins floating_point_6/m_axis_result_tdata] [get_bd_pins ReLu_0/relu_in]
connect_bd_net [get_bd_pins floating_point_6/m_axis_result_tvalid] [get_bd_pins axis_register_slice_0/s_axis_tvalid]
connect_bd_net -net xlconstant_0_dout [get_bd_pins Weight_0/dout] [get_bd_pins floating_point_0/s_axis_b_tdata]

current_bd_instance /NN/Multiplier_Adder_Relu_4
connect_bd_intf_net [get_bd_intf_pins M_AXIS_0] [get_bd_intf_pins axis_register_slice_0/M_AXIS]
connect_bd_intf_net [get_bd_intf_pins S_AXIS_A_0] [get_bd_intf_pins floating_point_0/S_AXIS_A]
connect_bd_intf_net [get_bd_intf_pins S_AXIS_A_1] [get_bd_intf_pins floating_point_1/S_AXIS_A]
connect_bd_intf_net [get_bd_intf_pins S_AXIS_A_2] [get_bd_intf_pins floating_point_2/S_AXIS_A]
connect_bd_intf_net [get_bd_intf_pins S_AXIS_A_3] [get_bd_intf_pins floating_point_3/S_AXIS_A]
connect_bd_intf_net [get_bd_intf_pins floating_point_0/M_AXIS_RESULT] [get_bd_intf_pins floating_point_4/S_AXIS_A]
connect_bd_intf_net [get_bd_intf_pins floating_point_1/M_AXIS_RESULT] [get_bd_intf_pins floating_point_4/S_AXIS_B]
connect_bd_intf_net [get_bd_intf_pins floating_point_2/M_AXIS_RESULT] [get_bd_intf_pins floating_point_5/S_AXIS_A]
connect_bd_intf_net [get_bd_intf_pins floating_point_3/M_AXIS_RESULT] [get_bd_intf_pins floating_point_5/S_AXIS_B]
connect_bd_intf_net [get_bd_intf_pins floating_point_4/M_AXIS_RESULT] [get_bd_intf_pins floating_point_6/S_AXIS_A]
connect_bd_intf_net [get_bd_intf_pins floating_point_5/M_AXIS_RESULT] [get_bd_intf_pins floating_point_6/S_AXIS_B]
connect_bd_net -net ReLu_0_output [get_bd_pins ReLu_0/relu_out] [get_bd_pins axis_register_slice_0/s_axis_tdata]
connect_bd_net [get_bd_pins Tvalid_0/dout] [get_bd_pins floating_point_0/s_axis_b_tvalid]
connect_bd_net [get_bd_pins Tvalid_1/dout] [get_bd_pins floating_point_1/s_axis_b_tvalid]
connect_bd_net [get_bd_pins Tvalid_2/dout] [get_bd_pins floating_point_2/s_axis_b_tvalid]
connect_bd_net [get_bd_pins Tvalid_3/dout] [get_bd_pins floating_point_3/s_axis_b_tvalid]
connect_bd_net [get_bd_pins Weight_1/dout] [get_bd_pins floating_point_1/s_axis_b_tdata]
connect_bd_net [get_bd_pins Weight_2/dout] [get_bd_pins floating_point_2/s_axis_b_tdata]
connect_bd_net [get_bd_pins Weight_3/dout] [get_bd_pins floating_point_3/s_axis_b_tdata]
connect_bd_net [get_bd_pins aclk] \
  [get_bd_pins floating_point_4/aclk] [get_bd_pins floating_point_6/aclk] [get_bd_pins floating_point_1/aclk] \
  [get_bd_pins floating_point_0/aclk] [get_bd_pins floating_point_5/aclk] [get_bd_pins floating_point_3/aclk] \
  [get_bd_pins floating_point_2/aclk] [get_bd_pins axis_register_slice_0/aclk]
connect_bd_net [get_bd_pins axis_register_slice_0/s_axis_tready] [get_bd_pins floating_point_6/m_axis_result_tready]
connect_bd_net [get_bd_pins floating_point_6/m_axis_result_tdata] [get_bd_pins ReLu_0/relu_in]
connect_bd_net [get_bd_pins floating_point_6/m_axis_result_tvalid] [get_bd_pins axis_register_slice_0/s_axis_tvalid]
connect_bd_net -net xlconstant_0_dout [get_bd_pins Weight_0/dout] [get_bd_pins floating_point_0/s_axis_b_tdata]

current_bd_instance /NN/Multiplier_Adder_Relu_5
connect_bd_intf_net [get_bd_intf_pins M_AXIS_0] [get_bd_intf_pins axis_register_slice_0/M_AXIS]
connect_bd_intf_net [get_bd_intf_pins S_AXIS_A_0] [get_bd_intf_pins floating_point_0/S_AXIS_A]
connect_bd_intf_net [get_bd_intf_pins S_AXIS_A_1] [get_bd_intf_pins floating_point_1/S_AXIS_A]
connect_bd_intf_net [get_bd_intf_pins S_AXIS_A_2] [get_bd_intf_pins floating_point_2/S_AXIS_A]
connect_bd_intf_net [get_bd_intf_pins S_AXIS_A_3] [get_bd_intf_pins floating_point_3/S_AXIS_A]
connect_bd_intf_net [get_bd_intf_pins floating_point_0/M_AXIS_RESULT] [get_bd_intf_pins floating_point_4/S_AXIS_A]
connect_bd_intf_net [get_bd_intf_pins floating_point_1/M_AXIS_RESULT] [get_bd_intf_pins floating_point_4/S_AXIS_B]
connect_bd_intf_net [get_bd_intf_pins floating_point_2/M_AXIS_RESULT] [get_bd_intf_pins floating_point_5/S_AXIS_A]
connect_bd_intf_net [get_bd_intf_pins floating_point_3/M_AXIS_RESULT] [get_bd_intf_pins floating_point_5/S_AXIS_B]
connect_bd_intf_net [get_bd_intf_pins floating_point_4/M_AXIS_RESULT] [get_bd_intf_pins floating_point_6/S_AXIS_A]
connect_bd_intf_net [get_bd_intf_pins floating_point_5/M_AXIS_RESULT] [get_bd_intf_pins floating_point_6/S_AXIS_B]
connect_bd_net -net ReLu_0_output [get_bd_pins ReLu_0/relu_out] [get_bd_pins axis_register_slice_0/s_axis_tdata]
connect_bd_net [get_bd_pins Tvalid_0/dout] [get_bd_pins floating_point_0/s_axis_b_tvalid]
connect_bd_net [get_bd_pins Tvalid_1/dout] [get_bd_pins floating_point_1/s_axis_b_tvalid]
connect_bd_net [get_bd_pins Tvalid_2/dout] [get_bd_pins floating_point_2/s_axis_b_tvalid]
connect_bd_net [get_bd_pins Tvalid_3/dout] [get_bd_pins floating_point_3/s_axis_b_tvalid]
connect_bd_net [get_bd_pins Weight_1/dout] [get_bd_pins floating_point_1/s_axis_b_tdata]
connect_bd_net [get_bd_pins Weight_2/dout] [get_bd_pins floating_point_2/s_axis_b_tdata]
connect_bd_net [get_bd_pins Weight_3/dout] [get_bd_pins floating_point_3/s_axis_b_tdata]
connect_bd_net [get_bd_pins aclk] \
  [get_bd_pins floating_point_4/aclk] [get_bd_pins floating_point_6/aclk] [get_bd_pins floating_point_1/aclk] \
  [get_bd_pins floating_point_0/aclk] [get_bd_pins floating_point_5/aclk] [get_bd_pins floating_point_3/aclk] \
  [get_bd_pins floating_point_2/aclk] [get_bd_pins axis_register_slice_0/aclk]
connect_bd_net [get_bd_pins axis_register_slice_0/s_axis_tready] [get_bd_pins floating_point_6/m_axis_result_tready]
connect_bd_net [get_bd_pins floating_point_6/m_axis_result_tdata] [get_bd_pins ReLu_0/relu_in]
connect_bd_net [get_bd_pins floating_point_6/m_axis_result_tvalid] [get_bd_pins axis_register_slice_0/s_axis_tvalid]
connect_bd_net -net xlconstant_0_dout [get_bd_pins Weight_0/dout] [get_bd_pins floating_point_0/s_axis_b_tdata]

current_bd_instance /NN/Multiplier_Adder_Relu_6
connect_bd_intf_net [get_bd_intf_pins M_AXIS_0] [get_bd_intf_pins axis_register_slice_0/M_AXIS]
connect_bd_intf_net [get_bd_intf_pins S_AXIS_A_0] [get_bd_intf_pins floating_point_0/S_AXIS_A]
connect_bd_intf_net [get_bd_intf_pins S_AXIS_A_1] [get_bd_intf_pins floating_point_1/S_AXIS_A]
connect_bd_intf_net [get_bd_intf_pins S_AXIS_A_2] [get_bd_intf_pins floating_point_2/S_AXIS_A]
connect_bd_intf_net [get_bd_intf_pins S_AXIS_A_3] [get_bd_intf_pins floating_point_3/S_AXIS_A]
connect_bd_intf_net [get_bd_intf_pins floating_point_0/M_AXIS_RESULT] [get_bd_intf_pins floating_point_4/S_AXIS_A]
connect_bd_intf_net [get_bd_intf_pins floating_point_1/M_AXIS_RESULT] [get_bd_intf_pins floating_point_4/S_AXIS_B]
connect_bd_intf_net [get_bd_intf_pins floating_point_2/M_AXIS_RESULT] [get_bd_intf_pins floating_point_5/S_AXIS_A]
connect_bd_intf_net [get_bd_intf_pins floating_point_3/M_AXIS_RESULT] [get_bd_intf_pins floating_point_5/S_AXIS_B]
connect_bd_intf_net [get_bd_intf_pins floating_point_4/M_AXIS_RESULT] [get_bd_intf_pins floating_point_6/S_AXIS_A]
connect_bd_intf_net [get_bd_intf_pins floating_point_5/M_AXIS_RESULT] [get_bd_intf_pins floating_point_6/S_AXIS_B]
connect_bd_net -net ReLu_0_output [get_bd_pins ReLu_0/relu_out] [get_bd_pins axis_register_slice_0/s_axis_tdata]
connect_bd_net [get_bd_pins Tvalid_0/dout] [get_bd_pins floating_point_0/s_axis_b_tvalid]
connect_bd_net [get_bd_pins Tvalid_1/dout] [get_bd_pins floating_point_1/s_axis_b_tvalid]
connect_bd_net [get_bd_pins Tvalid_2/dout] [get_bd_pins floating_point_2/s_axis_b_tvalid]
connect_bd_net [get_bd_pins Tvalid_3/dout] [get_bd_pins floating_point_3/s_axis_b_tvalid]
connect_bd_net [get_bd_pins Weight_1/dout] [get_bd_pins floating_point_1/s_axis_b_tdata]
connect_bd_net [get_bd_pins Weight_2/dout] [get_bd_pins floating_point_2/s_axis_b_tdata]
connect_bd_net [get_bd_pins Weight_3/dout] [get_bd_pins floating_point_3/s_axis_b_tdata]
connect_bd_net [get_bd_pins aclk] \
  [get_bd_pins floating_point_4/aclk] [get_bd_pins floating_point_6/aclk] [get_bd_pins floating_point_1/aclk] \
  [get_bd_pins floating_point_0/aclk] [get_bd_pins floating_point_5/aclk] [get_bd_pins floating_point_3/aclk] \
  [get_bd_pins floating_point_2/aclk] [get_bd_pins axis_register_slice_0/aclk]
connect_bd_net [get_bd_pins axis_register_slice_0/s_axis_tready] [get_bd_pins floating_point_6/m_axis_result_tready]
connect_bd_net [get_bd_pins floating_point_6/m_axis_result_tdata] [get_bd_pins ReLu_0/relu_in]
connect_bd_net [get_bd_pins floating_point_6/m_axis_result_tvalid] [get_bd_pins axis_register_slice_0/s_axis_tvalid]
connect_bd_net -net xlconstant_0_dout [get_bd_pins Weight_0/dout] [get_bd_pins floating_point_0/s_axis_b_tdata]

current_bd_instance /NN/Multiplier_Adder_Relu_7
connect_bd_intf_net [get_bd_intf_pins M_AXIS_0] [get_bd_intf_pins axis_register_slice_0/M_AXIS]
connect_bd_intf_net [get_bd_intf_pins S_AXIS_A_0] [get_bd_intf_pins floating_point_0/S_AXIS_A]
connect_bd_intf_net [get_bd_intf_pins S_AXIS_A_1] [get_bd_intf_pins floating_point_1/S_AXIS_A]
connect_bd_intf_net [get_bd_intf_pins S_AXIS_A_2] [get_bd_intf_pins floating_point_2/S_AXIS_A]
connect_bd_intf_net [get_bd_intf_pins S_AXIS_A_3] [get_bd_intf_pins floating_point_3/S_AXIS_A]
connect_bd_intf_net [get_bd_intf_pins floating_point_0/M_AXIS_RESULT] [get_bd_intf_pins floating_point_4/S_AXIS_A]
connect_bd_intf_net [get_bd_intf_pins floating_point_1/M_AXIS_RESULT] [get_bd_intf_pins floating_point_4/S_AXIS_B]
connect_bd_intf_net [get_bd_intf_pins floating_point_2/M_AXIS_RESULT] [get_bd_intf_pins floating_point_5/S_AXIS_A]
connect_bd_intf_net [get_bd_intf_pins floating_point_3/M_AXIS_RESULT] [get_bd_intf_pins floating_point_5/S_AXIS_B]
connect_bd_intf_net [get_bd_intf_pins floating_point_4/M_AXIS_RESULT] [get_bd_intf_pins floating_point_6/S_AXIS_A]
connect_bd_intf_net [get_bd_intf_pins floating_point_5/M_AXIS_RESULT] [get_bd_intf_pins floating_point_6/S_AXIS_B]
connect_bd_net -net ReLu_0_output [get_bd_pins ReLu_0/relu_out] [get_bd_pins axis_register_slice_0/s_axis_tdata]
connect_bd_net [get_bd_pins Tvalid_0/dout] [get_bd_pins floating_point_0/s_axis_b_tvalid]
connect_bd_net [get_bd_pins Tvalid_1/dout] [get_bd_pins floating_point_1/s_axis_b_tvalid]
connect_bd_net [get_bd_pins Tvalid_2/dout] [get_bd_pins floating_point_2/s_axis_b_tvalid]
connect_bd_net [get_bd_pins Tvalid_3/dout] [get_bd_pins floating_point_3/s_axis_b_tvalid]
connect_bd_net [get_bd_pins Weight_1/dout] [get_bd_pins floating_point_1/s_axis_b_tdata]
connect_bd_net [get_bd_pins Weight_2/dout] [get_bd_pins floating_point_2/s_axis_b_tdata]
connect_bd_net [get_bd_pins Weight_3/dout] [get_bd_pins floating_point_3/s_axis_b_tdata]
connect_bd_net [get_bd_pins aclk] \
  [get_bd_pins floating_point_4/aclk] [get_bd_pins floating_point_6/aclk] [get_bd_pins floating_point_1/aclk] \
  [get_bd_pins floating_point_0/aclk] [get_bd_pins floating_point_5/aclk] [get_bd_pins floating_point_3/aclk] \
  [get_bd_pins floating_point_2/aclk] [get_bd_pins axis_register_slice_0/aclk]
connect_bd_net [get_bd_pins axis_register_slice_0/s_axis_tready] [get_bd_pins floating_point_6/m_axis_result_tready]
connect_bd_net [get_bd_pins floating_point_6/m_axis_result_tdata] [get_bd_pins ReLu_0/relu_in]
connect_bd_net [get_bd_pins floating_point_6/m_axis_result_tvalid] [get_bd_pins axis_register_slice_0/s_axis_tvalid]
connect_bd_net -net xlconstant_0_dout [get_bd_pins Weight_0/dout] [get_bd_pins floating_point_0/s_axis_b_tdata]

current_bd_instance /
connect_bd_intf_net [get_bd_intf_pins system_ila_0/SLOT_0_AXIS] [get_bd_intf_pins NN/M_AXIS_0]
connect_bd_intf_net [get_bd_intf_pins system_ila_0/SLOT_1_AXIS] [get_bd_intf_pins NN/M_AXIS_1]
connect_bd_intf_net [get_bd_intf_pins system_ila_0/SLOT_2_AXIS] [get_bd_intf_pins NN/M_AXIS_2]
connect_bd_intf_net [get_bd_intf_pins system_ila_0/SLOT_3_AXIS] [get_bd_intf_pins NN/M_AXIS_3]
connect_bd_intf_net [get_bd_intf_ports usb_uart] [get_bd_intf_pins axi_uartlite_0/UART]
connect_bd_intf_net [get_bd_intf_pins microblaze_0/M_AXI_DP] [get_bd_intf_pins microblaze_0_axi_periph/S00_AXI]
connect_bd_intf_net [get_bd_intf_pins microblaze_0_axi_periph/M00_AXI] [get_bd_intf_pins axi_uartlite_0/S_AXI]
connect_bd_intf_net [get_bd_intf_pins microblaze_0_axi_periph/M01_AXI] [get_bd_intf_pins NN/S_AXI4]
connect_bd_intf_net [get_bd_intf_pins microblaze_0_axi_periph/M02_AXI] [get_bd_intf_pins NN/S_AXI5]
connect_bd_intf_net [get_bd_intf_pins microblaze_0_axi_periph/M03_AXI] [get_bd_intf_pins NN/S_AXI6]
connect_bd_intf_net [get_bd_intf_pins microblaze_0_axi_periph/M04_AXI] [get_bd_intf_pins NN/S_AXI7]
connect_bd_intf_net [get_bd_intf_pins microblaze_0_axi_periph/M05_AXI] [get_bd_intf_pins NN/S_AXI8]
connect_bd_intf_net [get_bd_intf_pins microblaze_0_axi_periph/M06_AXI] [get_bd_intf_pins NN/S_AXI]
connect_bd_intf_net [get_bd_intf_pins microblaze_0_axi_periph/M07_AXI] [get_bd_intf_pins NN/S_AXI1]
connect_bd_intf_net [get_bd_intf_pins microblaze_0_axi_periph/M08_AXI] [get_bd_intf_pins NN/S_AXI2]
connect_bd_intf_net [get_bd_intf_pins microblaze_0_axi_periph/M09_AXI] [get_bd_intf_pins NN/S_AXI3]
connect_bd_intf_net [get_bd_intf_pins mdm_1/MBDEBUG_0] [get_bd_intf_pins microblaze_0/DEBUG]
connect_bd_intf_net [get_bd_intf_pins microblaze_0/DLMB] [get_bd_intf_pins microblaze_0_local_memory/DLMB]
connect_bd_intf_net [get_bd_intf_pins microblaze_0/ILMB] [get_bd_intf_pins microblaze_0_local_memory/ILMB]
connect_bd_net -net BTND_0_1 [get_bd_ports BTND_0] [get_bd_pins Seven_Segments_0/BTND]
connect_bd_net -net BTNU_0_1 [get_bd_ports BTNU_0] [get_bd_pins Seven_Segments_0/BTNU]
connect_bd_net -net Multiplier_Adder_Relu_4_M_AXIS_0_tdata [get_bd_pins NN/M_AXIS_0_tdata] [get_bd_pins Seven_Segments_0/det0]
connect_bd_net -net Multiplier_Adder_Relu_5_M_AXIS_0_tdata [get_bd_pins NN/M_AXIS_0_tdata1] [get_bd_pins Seven_Segments_0/det1]
connect_bd_net -net Multiplier_Adder_Relu_6_M_AXIS_0_tdata [get_bd_pins NN/M_AXIS_0_tdata2] [get_bd_pins Seven_Segments_0/det2]
connect_bd_net -net Multiplier_Adder_Relu_7_M_AXIS_0_tdata [get_bd_pins NN/M_AXIS_0_tdata3] [get_bd_pins Seven_Segments_0/det3]
connect_bd_net [get_bd_pins Seven_Segments_0/AN] [get_bd_ports AN_0]
connect_bd_net [get_bd_pins Seven_Segments_0/CA] [get_bd_ports CA_0]
connect_bd_net [get_bd_pins Seven_Segments_0/CB] [get_bd_ports CB_0]
connect_bd_net [get_bd_pins Seven_Segments_0/CC] [get_bd_ports CC_0]
connect_bd_net [get_bd_pins Seven_Segments_0/CD] [get_bd_ports CD_0]
connect_bd_net [get_bd_pins Seven_Segments_0/CE] [get_bd_ports CE_0]
connect_bd_net [get_bd_pins Seven_Segments_0/CF] [get_bd_ports CF_0]
connect_bd_net [get_bd_pins Seven_Segments_0/CG] [get_bd_ports CG_0]
connect_bd_net [get_bd_pins Seven_Segments_0/DP] [get_bd_ports DP_0]
connect_bd_net [get_bd_pins clk_wiz_0/locked] [get_bd_pins rst_clk_wiz_0_100M/dcm_locked]
connect_bd_net -net control_gpio_io_o [get_bd_pins NN/S_AXIS_A_0_tvalid] [get_bd_pins system_ila_0/probe0]
connect_bd_net [get_bd_pins mdm_1/Debug_SYS_Rst] [get_bd_pins rst_clk_wiz_0_100M/mb_debug_sys_rst]
connect_bd_net -net microblaze_0_Clk [get_bd_pins clk_wiz_0/clk_out1] \
  [get_bd_pins axi_uartlite_0/s_axi_aclk] [get_bd_pins microblaze_0/Clk] [get_bd_pins microblaze_0_local_memory/LMB_Clk] \
  [get_bd_pins rst_clk_wiz_0_100M/slowest_sync_clk] [get_bd_pins microblaze_0_axi_periph/ACLK] \
  [get_bd_pins microblaze_0_axi_periph/S00_ACLK] [get_bd_pins microblaze_0_axi_periph/M00_ACLK] \
  [get_bd_pins microblaze_0_axi_periph/M01_ACLK] [get_bd_pins microblaze_0_axi_periph/M02_ACLK] \
  [get_bd_pins microblaze_0_axi_periph/M03_ACLK] [get_bd_pins microblaze_0_axi_periph/M04_ACLK] \
  [get_bd_pins microblaze_0_axi_periph/M05_ACLK] [get_bd_pins microblaze_0_axi_periph/M06_ACLK] \
  [get_bd_pins microblaze_0_axi_periph/M07_ACLK] [get_bd_pins microblaze_0_axi_periph/M08_ACLK] \
  [get_bd_pins microblaze_0_axi_periph/M09_ACLK] [get_bd_pins system_ila_0/clk] [get_bd_pins Seven_Segments_0/clock] \
  [get_bd_pins NN/aclk]
connect_bd_net [get_bd_ports reset] [get_bd_pins clk_wiz_0/resetn] [get_bd_pins rst_clk_wiz_0_100M/ext_reset_in]
connect_bd_net [get_bd_pins rst_clk_wiz_0_100M/bus_struct_reset] [get_bd_pins microblaze_0_local_memory/SYS_Rst]
connect_bd_net [get_bd_pins rst_clk_wiz_0_100M/mb_reset] [get_bd_pins microblaze_0/Reset]
connect_bd_net [get_bd_pins rst_clk_wiz_0_100M/peripheral_aresetn] \
  [get_bd_pins axi_uartlite_0/s_axi_aresetn] [get_bd_pins microblaze_0_axi_periph/S00_ARESETN] \
  [get_bd_pins microblaze_0_axi_periph/M00_ARESETN] [get_bd_pins microblaze_0_axi_periph/ARESETN] \
  [get_bd_pins microblaze_0_axi_periph/M01_ARESETN] [get_bd_pins microblaze_0_axi_periph/M02_ARESETN] \
  [get_bd_pins microblaze_0_axi_periph/M03_ARESETN] [get_bd_pins microblaze_0_axi_periph/M04_ARESETN] \
  [get_bd_pins microblaze_0_axi_periph/M05_ARESETN] [get_bd_pins microblaze_0_axi_periph/M06_ARESETN] \
  [get_bd_pins microblaze_0_axi_periph/M07_ARESETN] [get_bd_pins microblaze_0_axi_periph/M08_ARESETN] \
  [get_bd_pins microblaze_0_axi_periph/M09_ARESETN] [get_bd_pins system_ila_0/resetn] [get_bd_pins Seven_Segments_0/reset] \
  [get_bd_pins NN/s_axi_aresetn]
connect_bd_net [get_bd_ports sys_clock] [get_bd_pins clk_wiz_0/clk_in1]
set_property PFM.CLOCK {clk_out1 {id "2" is_default "true" proc_sys_reset "/rst_clk_wiz_0_100M" status "fixed" freq_hz "100000000"}} [get_bd_cells clk_wiz_0]
set_property HDL_ATTRIBUTE.BMM_INFO_PROCESSOR {microblaze-le > design_2 microblaze_0_local_memory/dlmb_bram_if_cntlr} [get_bd_cells microblaze_0]
set_property HDL_ATTRIBUTE.KEEP_HIERARCHY yes [get_bd_cells microblaze_0]
set_property PFM.AXI_PORT {M10_AXI {memport "M_AXI_GP" sptag "DDR" memory "" is_range "false"}} [get_bd_cells microblaze_0_axi_periph]
set_property HDL_ATTRIBUTE.DEBUG true [get_bd_nets control_gpio_io_o]
set_property HDL_ATTRIBUTE.MARK_DEBUG true [get_bd_nets control_gpio_io_o]
